# Altium project PCB_Node_ChapHanh.PrjPcb
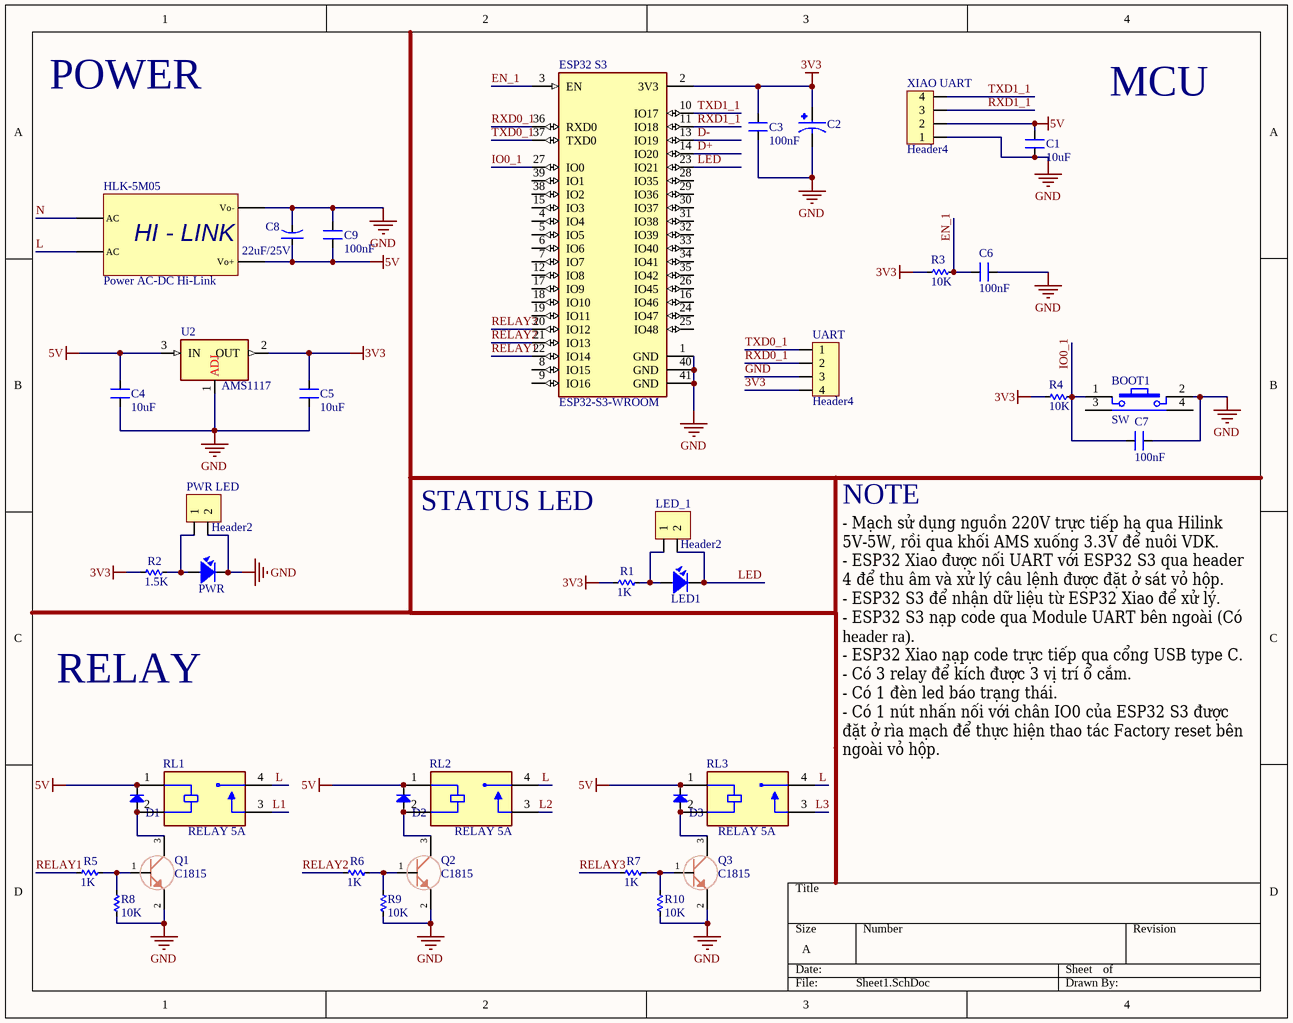
[diagram p0: Sheet1.SchDoc]
1 sheet, 38 parts. Net scope: global (net labels, ports and power ports of the same name join across sheets).
Board file: PCB2.PcbDoc

## Sheet Sheet1.SchDoc
size A; SheetNumber: 1; SheetTotal: 1

### Parts
BOOT1  SW  [TACTILE SWITCH TC-0203]
C1  10uF  [SM-0805]
C2  CAP_TANTALUM_SMD  [CAP_TANTALUM_3216]  (value not drawn)
C3  100nF  [SM-0805]
C4  10uF  [SM-0805]
C5  10uF  [SM-0805]
C6  100nF  [SM-0805]
C7  100nF  [SM-0805]
C8  22uF/25V  [CAP-ALU-SMD-D]
C9  100nF  [SM-0805]
D1  FR207  [DIO-SMD-106]  (value not drawn)
D2  FR207  [DIO-SMD-106]  (value not drawn)
D3  FR207  [DIO-SMD-106]  (value not drawn)
ESP32_S3  ESP32-S3-WROOM  [ESP32-S3-WROOM-1]
HLK-5M05  Power AC-DC Hi-Link  [HLK-5M05]
LED1  LED  [LED-0805-Red]  (value not drawn)
LED_1  Header2  [Header2]
PWR  LED  [LED-0805-Blue]  (value not drawn)
PWR_LED  Header2  [Header2]
Q1  C1815  [SOT23]
Q2  C1815  [SOT23]
Q3  C1815  [SOT23]
R1  1K  [RES-SMD-0805]
R2  1.5K  [RES-SMD-0805]
R3  10K  [RES-SMD-0805]
R4  10K  [RES-SMD-0805]
R5  1K  [RES-SMD-0805]
R6  1K  [RES-SMD-0805]
R7  1K  [RES-SMD-0805]
R8  10K  [RES-SMD-0805]
R9  10K  [RES-SMD-0805]
R10  10K  [RES-SMD-0805]
RL1  RELAY 5A  [RELAY 5A]
RL2  RELAY 5A  [RELAY 5A]
RL3  RELAY 5A  [RELAY 5A]
U2  AMS1117  [SOT223-4N]
UART  Header4  [Header4]
XIAO_UART  Header4  [Header4]

### Nets
3V3: C2.1 C3.2 C5.2 ESP32_S3.2(3V3) R1.2 R2.2 R3.2 R4.2 U2.2(OUT) UART.4
5V: C1.1 C4.2 C8.1 C9.1 D1.2(K) D2.2(K) D3.2(K) HLK-5M05.4(Vo+) RL1.1(COIL1) RL2.1(COIL1) RL3.1(COIL1) U2.3(IN) XIAO_UART.2
GND: BOOT1.2 C1.2 C2.2 C3.1 C4.1 C5.1 C6.1 C7.1 C8.2 C9.2 ESP32_S3.1(GND) ESP32_S3.40(GND) ESP32_S3.41(GND) HLK-5M05.3(Vo-) PWR.2 PWR_LED.2 Q1.2(E) Q2.2(E) Q3.2(E) R8.2 R9.2 R10.2 U2.1(ADJ) UART.3 XIAO_UART.1
D+: ESP32_S3.14(IO20)
D-: ESP32_S3.13(IO19)
EN_1: C6.2 ESP32_S3.3(EN) R3.1
IO0_1: BOOT1.1 C7.2 ESP32_S3.27(IO0) R4.1
L: HLK-5M05.2(AC) RL1.4(COM) RL2.4(COM) RL3.4(COM)
L1: RL1.3(NO)
L2: RL2.3(NO)
L3: RL3.3(NO)
LED: ESP32_S3.23(IO21) LED1.2 LED_1.2
N: HLK-5M05.1(AC)
RELAY1: ESP32_S3.22(IO14) R5.2
RELAY2: ESP32_S3.21(IO13) R6.2
RELAY3: ESP32_S3.20(IO12) R7.2
RXD0_1: ESP32_S3.36(RXD0) UART.2
RXD1_1: ESP32_S3.11(IO18) XIAO_UART.3
TXD0_1: ESP32_S3.37(TXD0) UART.1
TXD1_1: ESP32_S3.10(IO17) XIAO_UART.4
NetD1_1: D1.1(A) Q1.3(C) RL1.2(COIL2)
NetD2_1: D2.1(A) Q2.3(C) RL2.2(COIL2)
NetD3_1: D3.1(A) Q3.3(C) RL3.2(COIL2)
NetLED1_1: LED1.1 LED_1.1 R1.1
NetPWR_1: PWR.1 PWR_LED.1 R2.1
NetQ1_1: Q1.1(B) R5.1 R8.1
NetQ2_1: Q2.1(B) R6.1 R9.1
NetQ3_1: Q3.1(B) R7.1 R10.1

Not connected (* = marked no-connect by the designer): BOOT1 3 4; ESP32_S3 4(IO4) 5(IO5) 6(IO6) 7(IO7) 8(IO15) 9(IO16) 12(IO8) 15(IO3) 16(IO46) 17(IO9) 18(IO10) 19(IO11) 24(IO47) 25(IO48) 26(IO45) 28(IO35) 29(IO36) 30(IO37) 31(IO38) 32(IO39) 33(IO40) 34(IO41) 35(IO42) 38(IO2) 39(IO1)

### Notes on the sheet
- POWER
- MCU
- NOTE
- STATUS LED
- RELAY
- - Mạch sử dụng nguồn 220V trực tiếp hạ qua Hilink 5V-5W, rồi qua khối AMS xuống 3.3V để nuôi VDK.
  - ESP32 Xiao được nối UART với ESP32 S3 qua header 4 để thu âm và xử lý câu lệnh được đặt ở sát vỏ hộp.
  - ESP32 S3 để nhận dữ liệu từ ESP32 Xiao để xử lý.
  - ESP32 S3 nạp code qua Module UART bên ngoài (Có header ra).
  - ESP32 Xiao nạp code trực tiếp qua cổng USB type C.
  - Có 3 relay để kích được 3 vị trí ổ cắm.
  - Có 1 đèn led báo trạng thái.
  - Có 1 nút nhấn nối với chân IO0 của ESP32 S3 được đặt ở rìa mạch để thực hiện thao tác Factory reset bên ngoài vỏ hộp.
- (in symbol Power AC-DC Hi-Link) HI - LINK

### Library data of the parts
BOOT1 = SW4-DIP: Switch button 4 pin; Value: Button chip 4 pin
C1 C3-C7 C9 = CM: Cap SMD; Value: 103
C2 = CAP_TANTALUM_SMD: Capacitor, Tantalum; MF: AVX; MP: TAJB475K025RNJ; SnapEDA_Link: https://www.snapeda.com/parts/TAJB475K025RNJ/AVX/view-part/?ref=snap; Package: 1411 AVX Corporation; Value: *; Check_prices: https://www.snapeda.com/parts/TAJB475K025RNJ/AVX/view-part/?ref=eda
C8 = CN-ALU-SMD: Polarized Capacitor (Axial); Published: 8-Jun-2000; LatestRevisionDate: 17-Jul-2002; LatestRevisionNote: Re-released for DXP Platform.; PackageReference: POLAR0.8; Publisher: Altium Limited
D1-D3 = Diode SMD: Default Diode; Code - JEDEC: DO-214-AB; Value: 1N5007; Published: 8-Jun-2000; Revision: July-2002: Re-released for DXP Platform.; Publisher: Altium Limited
ESP32_S3 = ESP32-S3-WROOM: MF: {'manufacturer': u'Espressif Systems'}; MP: ESP32-S3-WROOM-1-N8; Package: None; Price: None; Value: *; Availability: Unavailable
HLK-5M05 = Power AC-DC Hi-Link: HLK
LED1 PWR = LED SMD: Value: LED 3 - 5 ly 2 Colour
LED_1 PWR_LED = Header2: Header IDC, 2 x 1 Pin Vertical 2.54mm Pitch (Non-Boxed, Male); Manufacturer: W¨¹rth Elektronik eiSos GmbH; partNo: 613002143121; ComponentLink1 Description: Manufacturer; ComponentLink2 Description: Datasheet; NoPins: 02; Created Date: 29 March 2013; ComponentLink1URL: http://www.we-online.com; ComponentLink2URL: http://katalog.we-online.de/em/datasheet/6130xx143121.pdf; Created by: Karrer Zheng
Q1-Q3 = Transitor SMD
R1-R10 = Res-SMD: Resistor; Manufacturer: Generic Components; Class: Passive; Published: 08/06/2000; Publisher: Altium Hobart Technology Centre
RL1-RL3 = RELAY 5A: 18.2 x 10.2 x 15.5 mm, 5 V, 5 A, SPST (1 Form A), Power Relay; MF: CUI Devices; MP: PR5-5V-200-1A; SnapEDA_Link: https://www.snapeda.com/parts/PR5-5V-200-1A/CUI+Devices/view-part/?ref=snap; Package: None; Value: *; CUI_purchase_URL: https://www.cuidevices.com/product/relays/power-relays/pr5-5v-200-1a?utm_source=snapeda.com&utm_medium=referral&utm_campaign=snapedaBOM; Check_prices: https://www.snapeda.com/parts/PR5-5V-200-1A/CUI+Devices/view-part/?ref=eda
U2 = AMS1117: IC
UART XIAO_UART = Header4: Header IDC, 4 x 1 Pin Vertical 2.54mm Pitch (Non-Boxed, Male); Manufacturer: W¨¹rth Elektronik eiSos GmbH; partNo: 613002143121; ComponentLink1 Description: Manufacturer; ComponentLink2 Description: Datasheet; NoPins: 02; Created Date: 29 March 2013; ComponentLink1URL: http://www.we-online.com; ComponentLink2URL: http://katalog.we-online.de/em/datasheet/6130xx143121.pdf; Created by: Karrer Zheng